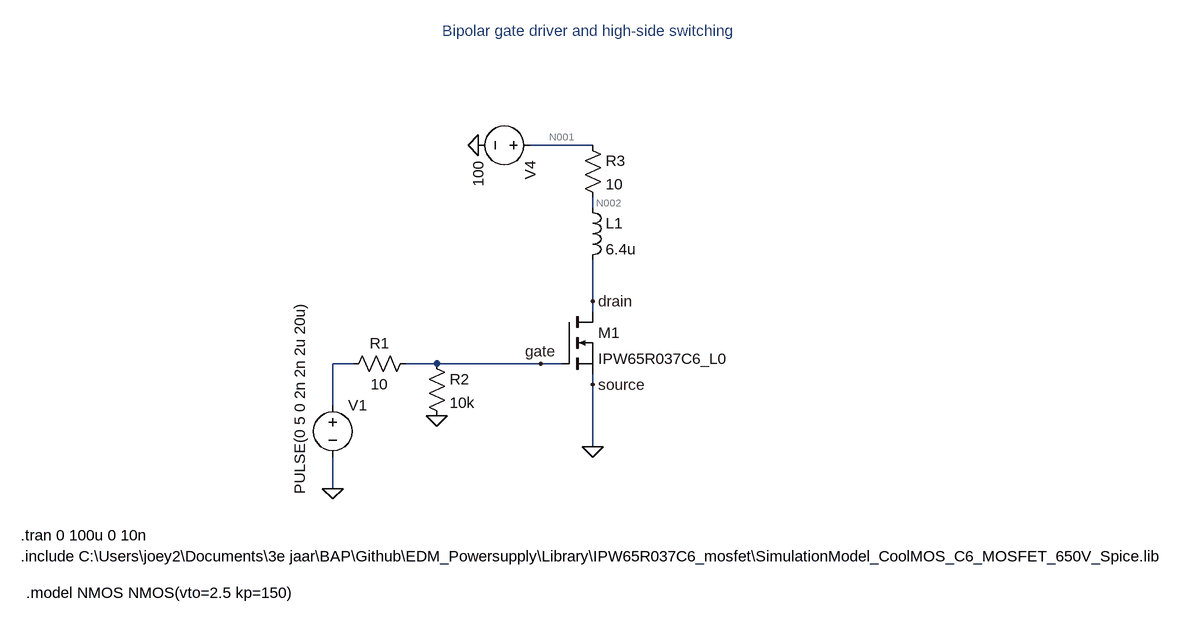
[diagram p0: schematic EDM_Powersupply_kicad_test.asc]
EDM_Powersupply_kicad_test.asc, the LTspice schematic file:
Version 4
SHEET 1 1356 732
WIRE 144 32 48 32
WIRE 144 128 144 112
WIRE 144 272 144 208
WIRE 144 288 144 272
WIRE -224 368 -256 368
WIRE -96 368 -144 368
WIRE 64 368 -96 368
WIRE 96 368 64 368
WIRE 144 400 144 384
WIRE -256 432 -256 368
WIRE 144 496 144 400
WIRE -256 560 -256 512
FLAG -256 560 0
FLAG 144 272 drain
FLAG 144 400 source
FLAG -96 448 0
FLAG -32 32 0
FLAG 144 496 0
FLAG 64 368 gate
SYMBOL voltage -256 416 R0
WINDOW 123 0 0 Left 0
WINDOW 39 0 0 Left 0
WINDOW 3 -51 153 VLeft 2
SYMATTR Value PULSE(0 5 0 2n 2n 2u 20u)
SYMATTR InstName V1
SYMBOL res -128 352 R90
WINDOW 0 0 56 VBottom 2
WINDOW 3 32 56 VTop 2
SYMATTR InstName R1
SYMATTR Value 10
SYMBOL voltage 64 32 R90
WINDOW 123 0 0 Left 0
WINDOW 39 0 0 Left 0
SYMATTR InstName V4
SYMATTR Value 100
SYMBOL nmos 96 288 R0
SYMATTR InstName M1
SYMATTR Value IPW65R037C6_L0
SYMATTR Prefix X
SYMBOL res -112 352 R0
SYMATTR InstName R2
SYMATTR Value 10k
SYMBOL ind 128 112 R0
SYMATTR InstName L1
SYMATTR Value 6.4u
SYMBOL res 128 16 R0
SYMATTR InstName R3
SYMATTR Value 10
TEXT -736 664 Left 2 !.include C:\\Users\\joey2\\Documents\\3e jaar\\BAP\\Github\\EDM_Powersupply\\Library\\IPW65R037C6_mosfet\\SimulationModel_CoolMOS_C6_MOSFET_650V_Spice.lib
TEXT -736 632 Left 2 !.tran 0 100u 0 10n
TEXT -728 720 Left 2 !.model NMOS NMOS(vto=2.5 kp=150)
TEXT -88 -144 Left 2 ;Bipolar gate driver and high-side switching

The netlist it stands for:
* EDM_Powersupply_kicad_test.asc
V1 N003 0 PULSE(0 5 0 2n 2n 2u 20u)
R1 gate N003 10
V4 N001 0 100
XM1 drain gate 0 IPW65R037C6_L0  ; pins D G S
R2 gate 0 10k
L1 N002 drain 6.4u
R3 N001 N002 10
.include C:\Users\joey2\Documents\3e jaar\BAP\Github\EDM_Powersupply\Library\IPW65R037C6_mosfet\SimulationModel_CoolMOS_C6_MOSFET_650V_Spice.lib
.tran 0 100u 0 10n
.model NMOS NMOS(vto=2.5 kp=150)
* Bipolar gate driver and high-side switching
.backanno
.end

* Results of the author's LTspice run, read from the files saved beside the schematic
* Operating Point, zero values left out:
*   V(gate) = 99.9 µV
*   V(n001) = 100 V
*   V(drain) = 100 V
*   V(n002) = 100 V
*   I(L1) = 10 µA
*   I(R3) = 10 µA
*   I(R2) = 9.99 nA
*   I(R1) = 9.99 µA
*   I(V4) = -10 µA
*   I(V1) = 9.99 µA
*   Ix(m1:DRAIN) = 10 µA
*   Ix(m1:GATE) = -10 µA
*   Ix(m1:SOURCE) = -416.8 pA
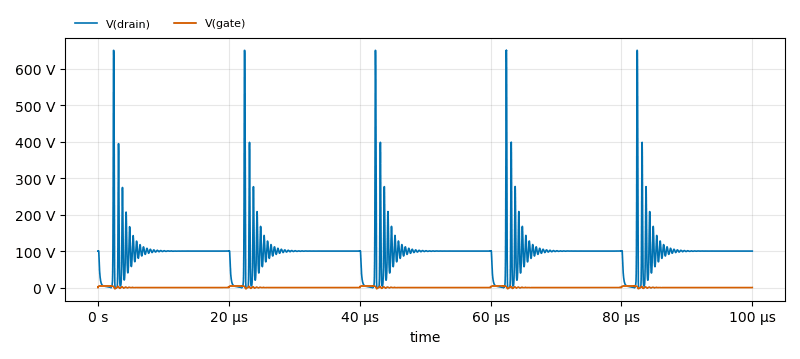
[diagram p1: Transient Analysis of EDM_Powersupply_kicad_test.asc, plotted from the saved traces]
* Transient Analysis, 1 run:
*   V(drain): min -543.7 mV, max 650.1 V, average 92.94 V, rms 111.4 V, last 100 V
*   V(gate): min -3.372 V, max 4.766 V, average 499.7 mV, rms 1.552 V, last 102.1 µV